# EAGLE design Joe_final hack4 (EAGLE 7.5.0)
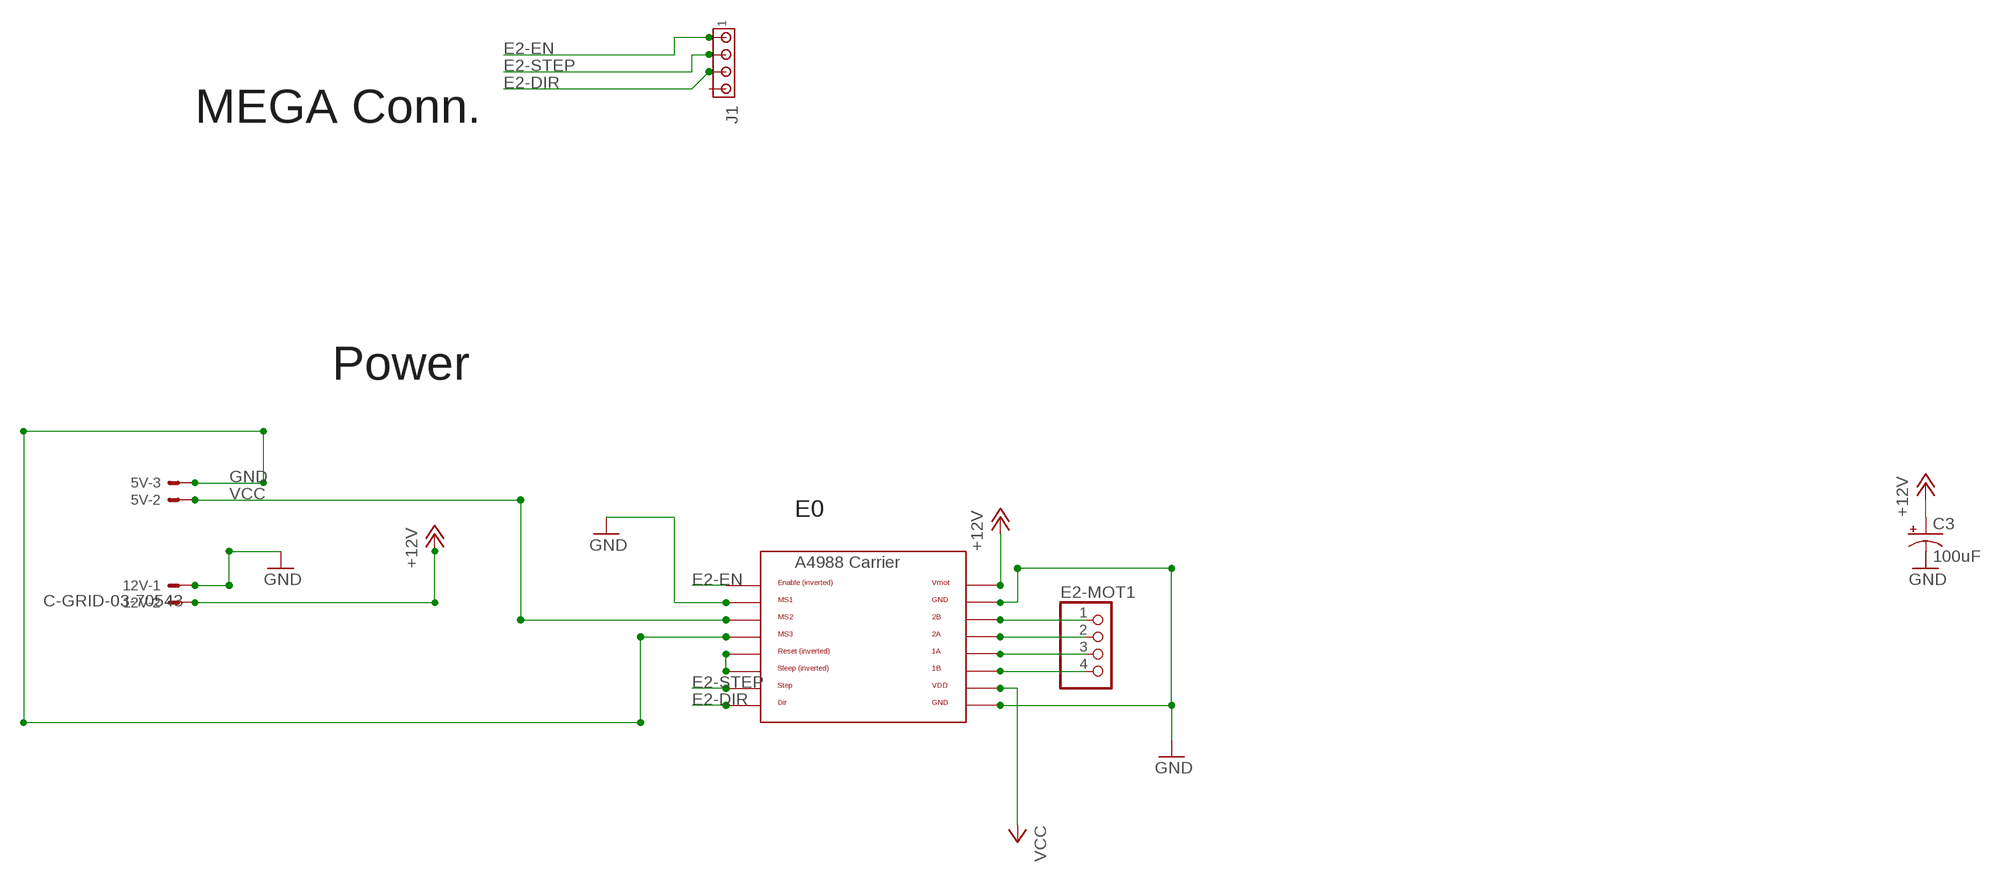
[diagram p0: schematic, sheet 1]

## Parts
5V  C-GRID-03-70543  [70543-03]
12V  C-GRID-03-70543  [70543-03]
C3  100uF  CPOL-US153CLV-0605  [153CLV-0605]
E2-MOT1  PINHD-1X4  [1X04]
J1  MTA04-156  [1X4MTA]
U$4  A4988BREAKOUT  [A4988BREAKOUT]

## Nets
+12V: 12V.2 C3.+ U$4.VMOT
E2-DIR: J1.3 U$4.DIR
E2-EN: J1.1 U$4.EN
E2-STEP: J1.2 U$4.STEP
GND: 5V.3 12V.1 C3.- U$4.GND U$4.GND@0(GND) U$4.MS1 U$4.MS3
N$4: E2-MOT1.1 U$4.2B
N$8: U$4.RST U$4.SLP(SLEEP)
N$10: E2-MOT1.2 U$4.2A
N$11: E2-MOT1.3 U$4.1A
N$12: E2-MOT1.4 U$4.1B
VCC: 5V.2 U$4.MS2 U$4.VDD
Unconnected: 5V.1 12V.3 J1.4

## Notes on the sheet
- MEGA Conn.
- Power
- E0

## Library data of the parts
5V 12V = con-molex:C-GRID-03: CONNECTOR wire to board 2.54 mm (0.100") pitch header; OC_FARNELL: unknown; OC_NEWARK: unknown
C3 = adafruit:CPOL-US: POLARIZED CAPACITOR, American symbol
E2-MOT1 = RepRapjr:PINHD-1X4: PIN HEADER
J1 = con-amp:MTA04-156: AMP connector
U$4 = RepRapjr:A4988BREAKOUT

## Board
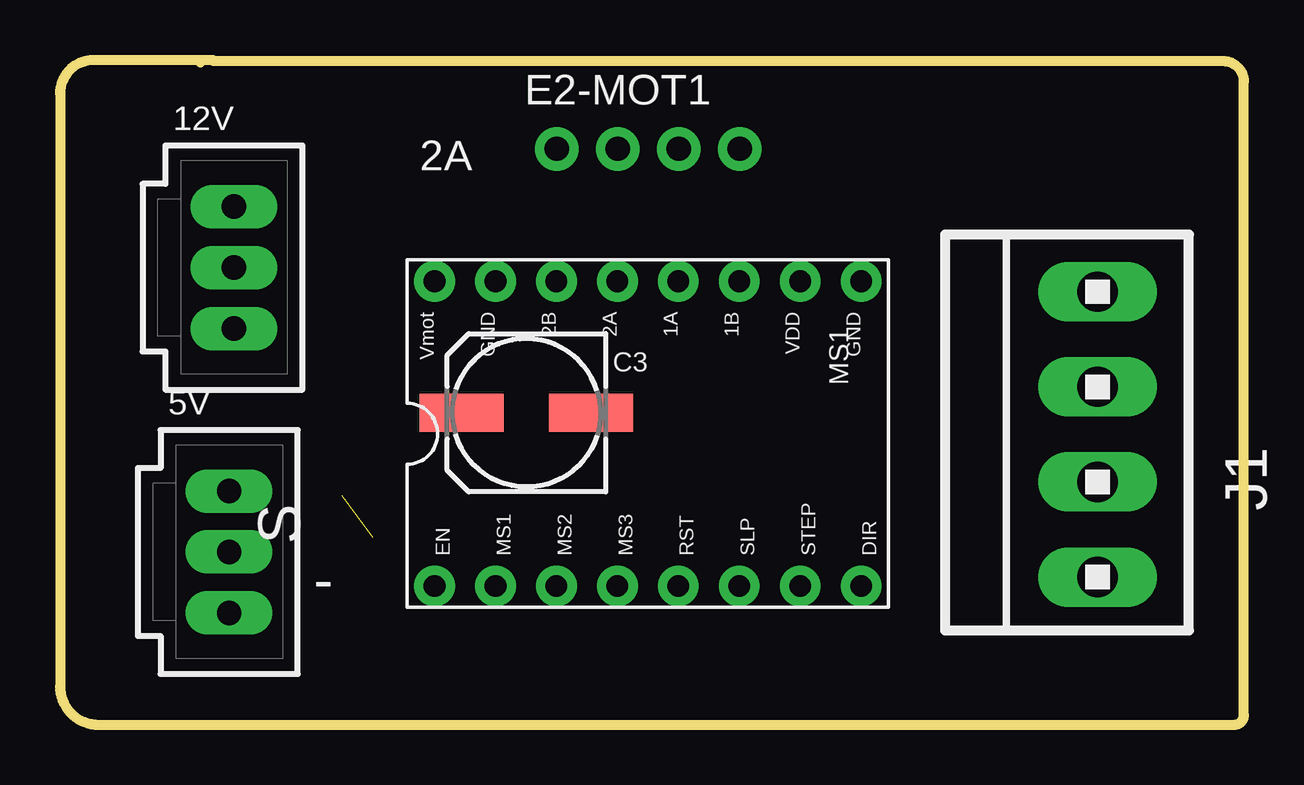
[diagram p1: board, top side]
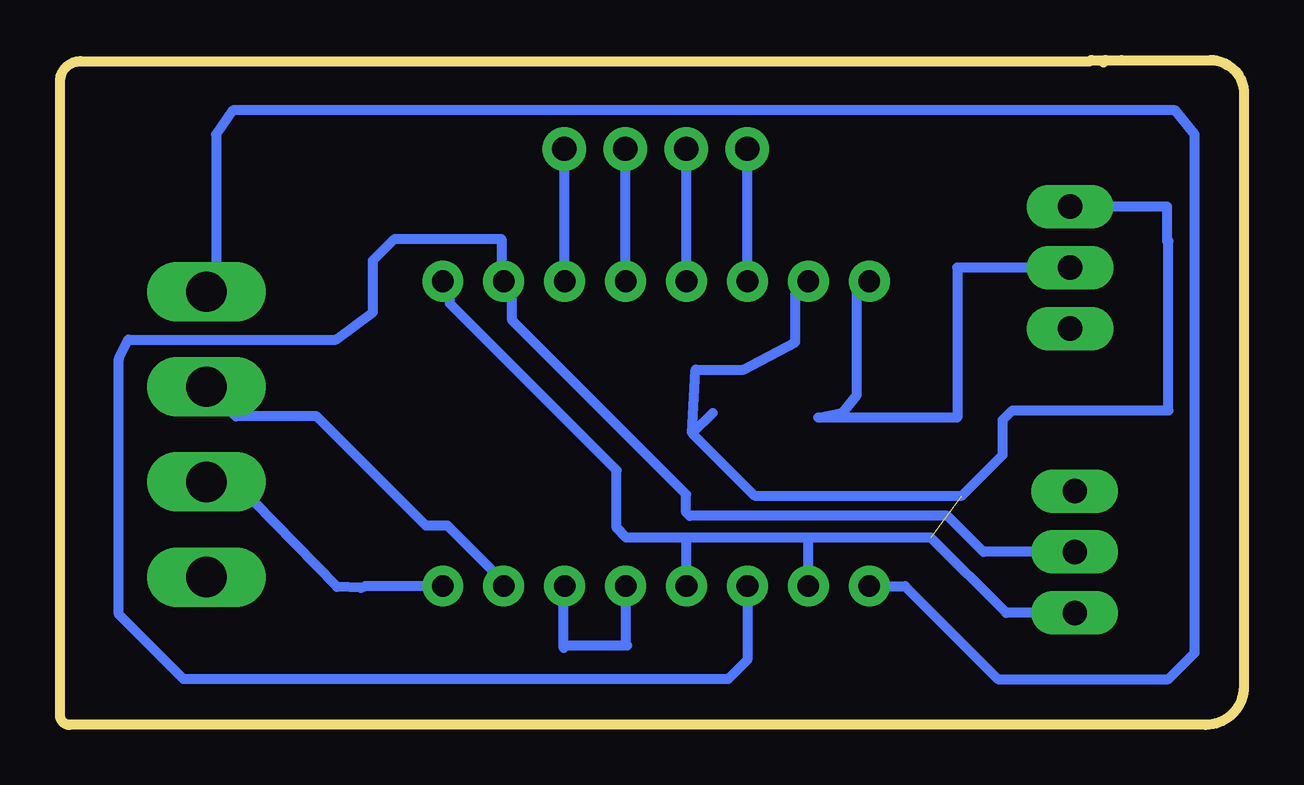
[diagram p2: board, bottom side, seen from below]

Size 49.35 x 27.7 mm. Coordinates in mm from the lower left corner, seen from the top.
Outline: 5.85,27.6 arc90 5.75,27.7
Outline: 5.75,27.7 5.1,27.7 1.4,27.7 arc90 0,26.3 0,1.6 arc90 1.6,0 48.95,0 arc90 49.35,0.4 49.35,26.8 arc90 48.5,27.65 6.4,27.65 arc90 6.35,27.7 5.75,27.7
Copper layers (1*16): Top 0.035mm / dielectric 1.6mm / Bottom 0.035mm
Design rules "PCB-CART *": minimum track width 0.1mm, minimum drill 0.1mm, track to track 16mil, track to pad 16mil, pad to pad 16mil, via to via 16mil, smd to smd 16mil, copper to edge 0.1mm, drill to drill 0.1mm, minimum pad ring 0.4mm, minimum via ring 0.3mm, stop-mask expansion 3mil, vias tented up to drill 0.5mm, thermal gap 12mil

### Footprints (pad centres in the part's own frame; a part is rotated, then mirrored left to right if it is on the bottom)
70543-03 = drill 1.016 long: 1 -2.54,0; 2 0,0; 3 2.54,0
153CLV-0605 = smd 3.5 x 1.6: + 2.7,0; - -2.7,0
1X04 = drill 1.016: 1 -2.54,0; 2 0,0; 3 2.54,0; 4 5.08,0
1X4MTA = drill 1.676 long: 1 5.944,0; 2 1.981,0; 3 -1.981,0; 4 -5.944,0
A4988BREAKOUT = drill 0.9: 1A 8.89,1.27; 1B 11.43,1.27; 2A 6.35,1.27; 2B 3.81,1.27; DIR 16.51,-11.43; EN -1.27,-11.43; GND 16.51,1.27; GND@0 1.27,1.27; MS1 1.27,-11.43; MS2 3.81,-11.43; MS3 6.35,-11.43; RST 8.89,-11.43; SLP 11.43,-11.43; STEP 13.97,-11.43; VDD 13.97,1.27; VMOT -1.27,1.27

### Placement (x,y rotation side)
5V  7.05,7.2 270 top
12V  7.25,19.05 270 top
C3  19.44,13 180 top
E2-MOT1  23.25,24 0 top
J1  43.25,12.1 90 top
U$4  16.88,17.21 0 top

### Tracks (layer width: path | path; a pad name or v marks a point on that pad's centre or on a via)
+12V
  Bottom 0.406: 12V.2 11.95,19.05 11.95,12.8 17.74,12.8 C3.+ 16.15,13.74 16.15,18.48 U$4.VMOT
E2-DIR
  Bottom 0.406: U$4.DIR 36.62,5.78 36.8,5.7 37.8,5.75 41.25,9.3 42.43,9.3 J1.3
E2-EN
  Bottom 0.406: U$4.EN 14.13,5.78 10.25,1.9 3.15,1.9 2.05,3 2.05,24.6 2.85,25.6 42.15,25.6 42.85,24.6 42.85,18.44 J1.1
E2-STEP
  Bottom 0.406: U$4.STEP 30.86,5.95 33.2,8.3 34.1,8.3 38.65,12.85 42.02,12.85 J1.2
GND  (1 unrouted)
  Bottom 0.406: C3.- 23,12.15 | 23,12.15 20.4,9.55 11.75,9.55 10.05,11.25 10.05,12.7 9.65,13.1 3.15,13.1 3.15,20.15 3.2,20.15 3.2,21.59 12V.1 | 23,12.15 22.85,14.8 20.85,14.8 18.7,15.95 18.7,17.93 U$4.GND@0 | 5V.3 9.91,4.66 13.05,7.8 18.05,7.8 | 18.05,7.8 23.1,7.8 | 23.1,7.8 25.75,7.8 26.15,8.2 26.15,10.6 33.1,17.55 33.1,18.18 U$4.GND | U$4.MS1 18.16,7.7 18.05,7.8 | U$4.MS3 23.23,7.66 23.1,7.8
N$4
  Bottom 0.406: U$4.2B 20.7,23.98 E2-MOT1.1
N$8
  Bottom 0.406: U$4.RST 25.77,3.38 25.7,3.3 28.25,3.3 28.35,3.2 28.35,5.74 U$4.SLP
N$10
  Bottom 0.406: U$4.2A 23.23,23.98 E2-MOT1.2
N$11
  Bottom 0.406: U$4.1A 25.77,23.98 E2-MOT1.3
N$12
  Bottom 0.406: U$4.1B 28.31,23.98 E2-MOT1.4
VCC
  Bottom 0.406: 5V.2 10.85,7.2 12.35,8.7 23.1,8.7 23.25,8.85 23.25,9.6 30.5,16.85 30.5,18.12 U$4.VDD 30.95,18.57 30.95,20.25 35.4,20.25 36.3,19.35 36.3,17.2 37.85,16.05 46.5,16.05 46.9,15.25 46.9,4.6 44.2,1.9 21.5,1.9 20.7,2.7 U$4.MS2

### Text on the board
tNames: 2A | MS1 | S | -
Holes: /x3 stepper expander
Document: RAMPS 1.4.2.1 (RepRap Arduino MEGA Pololu Shield) | reprap.org/wiki/RAMPS1.4 | Reversing input power, and inserting stepper drivers incorrectly will destroy electronics.
_tsilk: + | I2C | END STOPS | 21 | 1 | 20 | 1 | - | + | 1 | + | 1 | 1 | 1 | 1 | 1 | 1 | 1 | -